# Altium schematic sheet PORT_TYPE-C.SchDoc
size 420 x 297 mm; SheetNumber: 15; SheetTotal: 23
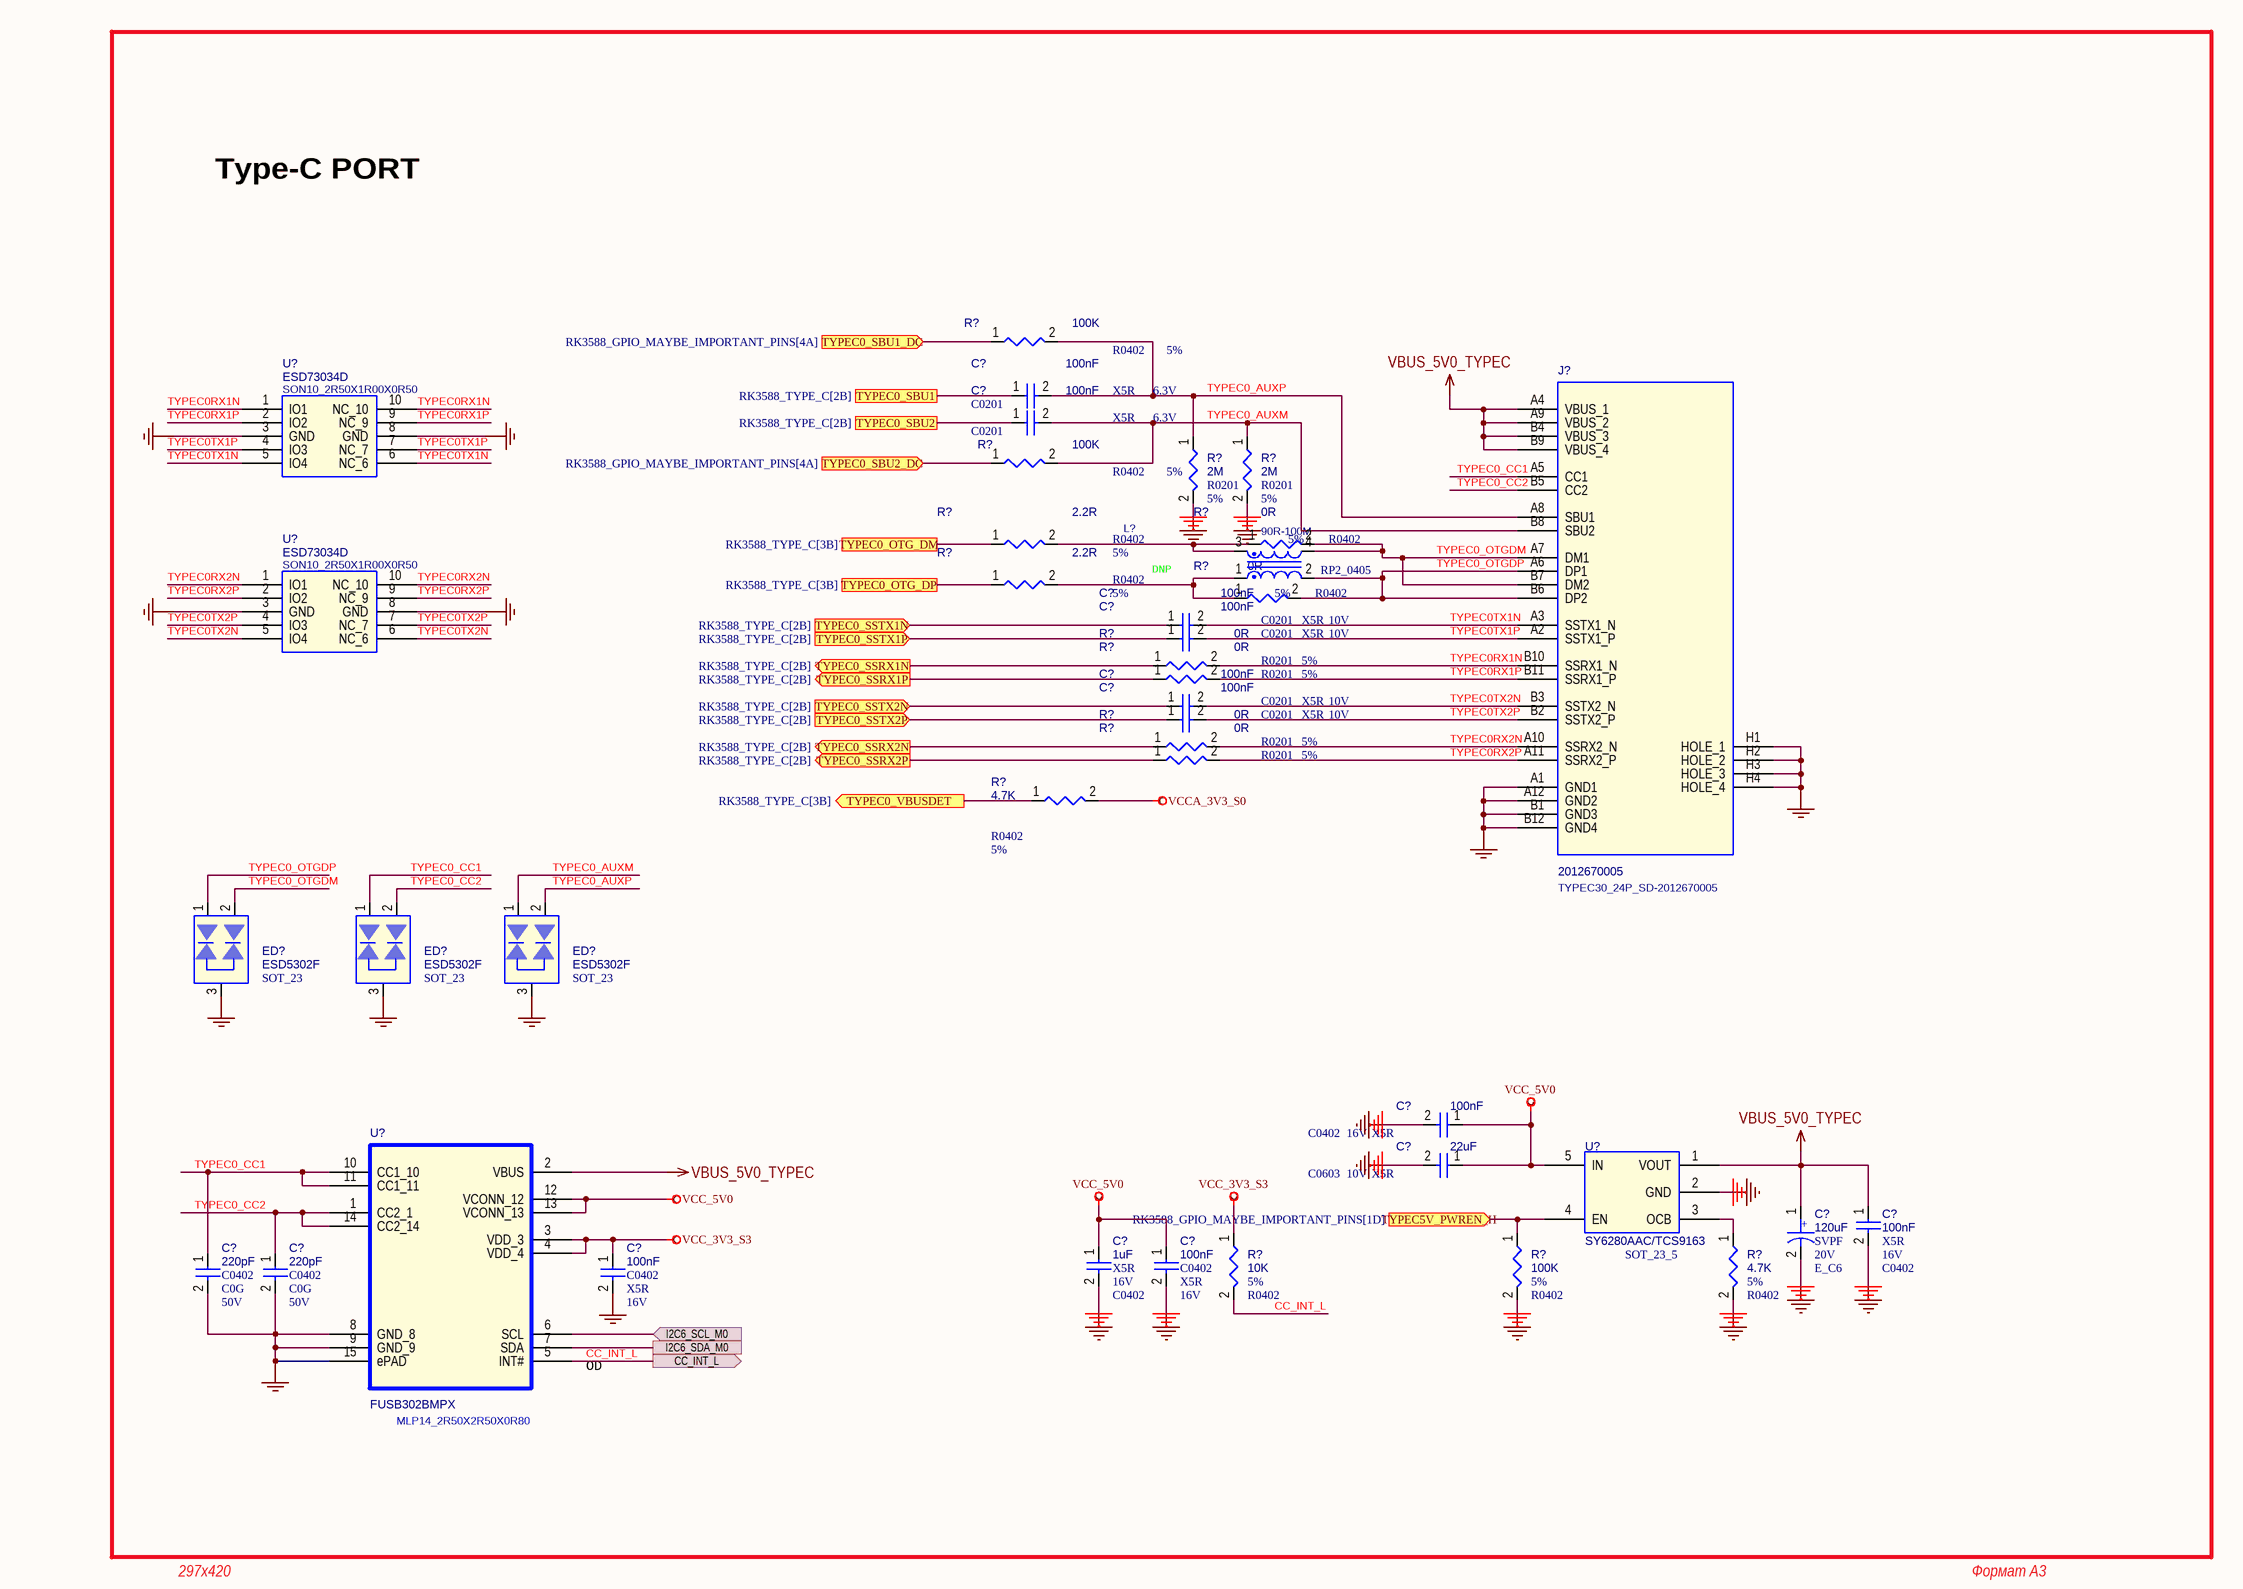
[diagram p0: PORT_TYPE-C.SchDoc]

## Parts
(Parts that share a designator on the sheet are numbered #1, #2 ... from top to bottom, then left to right.)
C?#1  100nF  Dielectric: X5R  Voltage: 6.3V  [C0201]
C?#2  100nF  Dielectric: X5R  Voltage: 6.3V  [C0201]
C?#3  100nF  Dielectric: X5R  Voltage: 10V  [C0201]
C?#4  100nF  Dielectric: X5R  Voltage: 10V  [C0201]
C?#5  100nF  Dielectric: X5R  Voltage: 10V  [C0201]
C?#6  100nF  Dielectric: X5R  Voltage: 10V  [C0201]
C?#7  100nF  Dielectric: X5R  Voltage: 16V  [C0402]
C?#8  22uF  Dielectric: X5R  Voltage: 10V  [C0603]
C?#9  120uF  Voltage: 20V  Dielectric: SVPF  [E_C6]
C?#10  100nF  Dielectric: X5R  Voltage: 16V  [C0402]
C?#11  1uF  Dielectric: X5R  Voltage: 16V  [C0402]
C?#12  100nF  Dielectric: X5R  Voltage: 16V  [C0402]
C?#13  220pF  Dielectric: C0G  Voltage: 50V  [C0402]
C?#14  220pF  Dielectric: C0G  Voltage: 50V  [C0402]
C?#15  100nF  Dielectric: X5R  Voltage: 16V  [C0402]
ED?#1  ESD5302F  [SOT_23]
ED?#2  ESD5302F  [SOT_23]
ED?#3  ESD5302F  [SOT_23]
J?  2012670005  [TYPEC30_24P_SD-2012670005]
L?  90R-100M  PCB Footprint: RP2_0405  OPTION: DNP  [L0402D]
R?#1  100K  Tolerance: 5%  [R0402]
R?#2  2M  Tolerance: 5%  PCB Footprint: R0201  [R0402]
R?#3  2M  Tolerance: 5%  PCB Footprint: R0201  [R0402]
R?#4  100K  Tolerance: 5%  [R0402]
R?#5  2.2R  Tolerance: 5%  [R0402]
R?#6  0R  Tolerance: 5%  [R0402]
R?#7  2.2R  Tolerance: 5%  [R0402]
R?#8  0R  Tolerance: 5%  [R0402]
R?#9  0R  Tolerance: 5%  PCB Footprint: R0201  [R0402]
R?#10  0R  Tolerance: 5%  PCB Footprint: R0201  [R0402]
R?#11  0R  Tolerance: 5%  PCB Footprint: R0201  [R0402]
R?#12  0R  Tolerance: 5%  PCB Footprint: R0201  [R0402]
R?#13  4.7K  Tolerance: 5%  [R0402]
R?#14  10K  Tolerance: 5%  [R0402]
R?#15  100K  Tolerance: 5%  [R0402]
R?#16  4.7K  Tolerance: 5%  [R0402]
U?#1  ESD73034D  [SON10_2R50X1R00X0R50]
U?#2  ESD73034D  [SON10_2R50X1R00X0R50]
U?#3  FUSB302BMPX  [MLP14_2R50X2R50X0R80]
U?#4  SY6280AAC/TCS9163  [SOT_23_5]

## Ports
CC_INT_L (out, see RK3588_OSC_PLL[3C]), I2C6_SCL_M0 (in, see RK3588_OSC_PLL[3C]), I2C6_SDA_M0 (see RK3588_OSC_PLL[3C]), TYPEC0_OTG_DM (see RK3588_TYPE_C[3B]), TYPEC0_OTG_DP (see RK3588_TYPE_C[3B]), TYPEC0_SBU1 (see RK3588_TYPE_C[2B]), TYPEC0_SBU1_DC (in, see RK3588_GPIO_MAYBE_IMPORTANT_PINS[4A]), TYPEC0_SBU2 (see RK3588_TYPE_C[2B]), TYPEC0_SBU2_DC (in, see RK3588_GPIO_MAYBE_IMPORTANT_PINS[4A]), TYPEC0_SSRX1N (out, see RK3588_TYPE_C[2B]), TYPEC0_SSRX1P (out, see RK3588_TYPE_C[2B]), TYPEC0_SSRX2N (out, see RK3588_TYPE_C[2B]), TYPEC0_SSRX2P (out, see RK3588_TYPE_C[2B]), TYPEC0_SSTX1N (in, see RK3588_TYPE_C[2B]), TYPEC0_SSTX1P (in, see RK3588_TYPE_C[2B]), TYPEC0_SSTX2N (in, see RK3588_TYPE_C[2B]), TYPEC0_SSTX2P (in, see RK3588_TYPE_C[2B]), TYPEC0_VBUSDET (out, see RK3588_TYPE_C[3B]), TYPEC5V_PWREN_H (in, see RK3588_GPIO_MAYBE_IMPORTANT_PINS[1D])

## Nets
GND: C?#7.2 C?#8.2 C?#9.2 C?#10.2 C?#11.2 C?#12.2 C?#13.2 C?#14.2 C?#15.2 ED?#1.3 ED?#2.3 ED?#3.3 J?.A1(GND1) J?.A12(GND2) J?.B1(GND3) J?.B12(GND4) J?.H1(HOLE_1) J?.H2(HOLE_2) J?.H3(HOLE_3) J?.H4(HOLE_4) R?#2.2 R?#3.2 R?#15.2 R?#16.2 U?#1.3(GND) U?#1.8(GND) U?#2.3(GND) U?#2.8(GND) U?#3.8(GND_8) U?#3.9(GND_9) U?#3.15(ePAD) U?#4.2(GND)
VBUS_5V0_TYPEC: C?#9.1 C?#10.1 J?.A4(VBUS_1) J?.A9(VBUS_2) J?.B4(VBUS_3) J?.B9(VBUS_4) U?#3.2(VBUS) U?#4.1(VOUT)
VCC_3V3_S3: C?#15.1 R?#14.1 U?#3.3(VDD_3) U?#3.4(VDD_4)
VCC_5V0: C?#7.1 C?#8.1 C?#11.1 C?#12.1 U?#3.12(VCONN_12) U?#3.13(VCONN_13) U?#4.5(IN)
VCCA_3V3_S0: R?#13.2
CC_INT_L: R?#14.2 U?#3.5(INT#) ; port CC_INT_L
I2C6_SCL_M0: U?#3.6(SCL) ; port I2C6_SCL_M0
I2C6_SDA_M0: U?#3.7(SDA) ; port I2C6_SDA_M0
TYPEC0_AUXM: C?#2.2 ED?#3.1 J?.B8(SBU2) R?#3.1 R?#4.2
TYPEC0_AUXP: C?#1.2 ED?#3.2 J?.A8(SBU1) R?#1.2 R?#2.1
TYPEC0_CC1: C?#13.1 ED?#2.1 J?.A5(CC1) U?#3.10(CC1_10) U?#3.11(CC1_11)
TYPEC0_CC2: C?#14.1 ED?#2.2 J?.B5(CC2) U?#3.1(CC2_1) U?#3.14(CC2_14)
TYPEC0_OTG_DM: R?#5.1 ; port TYPEC0_OTG_DM
TYPEC0_OTG_DP: R?#7.1 ; port TYPEC0_OTG_DP
TYPEC0_OTGDM: ED?#1.2 J?.A7(DM1) J?.B7(DM2) L?.4 R?#6.2
TYPEC0_OTGDP: ED?#1.1 J?.A6(DP1) J?.B6(DP2) L?.2 R?#8.2
TYPEC0_SBU1: C?#1.1 ; port TYPEC0_SBU1
TYPEC0_SBU1_DC: R?#1.1 ; port TYPEC0_SBU1_DC
TYPEC0_SBU2: C?#2.1 ; port TYPEC0_SBU2
TYPEC0_SBU2_DC: R?#4.1 ; port TYPEC0_SBU2_DC
TYPEC0_SSRX1N: R?#9.1 ; port TYPEC0_SSRX1N
TYPEC0_SSRX1P: R?#10.1 ; port TYPEC0_SSRX1P
TYPEC0_SSRX2N: R?#11.1 ; port TYPEC0_SSRX2N
TYPEC0_SSRX2P: R?#12.1 ; port TYPEC0_SSRX2P
TYPEC0_SSTX1N: C?#3.1 ; port TYPEC0_SSTX1N
TYPEC0_SSTX1P: C?#4.1 ; port TYPEC0_SSTX1P
TYPEC0_SSTX2N: C?#5.1 ; port TYPEC0_SSTX2N
TYPEC0_SSTX2P: C?#6.1 ; port TYPEC0_SSTX2P
TYPEC0_VBUSDET: R?#13.1 ; port TYPEC0_VBUSDET
TYPEC0RX1N: J?.B10(SSRX1_N) R?#9.2 U?#1.1(IO1) U?#1.10(NC_10)
TYPEC0RX1P: J?.B11(SSRX1_P) R?#10.2 U?#1.2(IO2) U?#1.9(NC_9)
TYPEC0RX2N: J?.A10(SSRX2_N) R?#11.2 U?#2.1(IO1) U?#2.10(NC_10)
TYPEC0RX2P: J?.A11(SSRX2_P) R?#12.2 U?#2.2(IO2) U?#2.9(NC_9)
TYPEC0TX1N: C?#3.2 J?.A3(SSTX1_N) U?#1.5(IO4) U?#1.6(NC_6)
TYPEC0TX1P: C?#4.2 J?.A2(SSTX1_P) U?#1.4(IO3) U?#1.7(NC_7)
TYPEC0TX2N: C?#5.2 J?.B3(SSTX2_N) U?#2.5(IO4) U?#2.6(NC_6)
TYPEC0TX2P: C?#6.2 J?.B2(SSTX2_P) U?#2.4(IO3) U?#2.7(NC_7)
TYPEC5V_PWREN_H: R?#15.1 U?#4.4(EN) ; port TYPEC5V_PWREN_H
NetL?_1: L?.1 R?#7.2 R?#8.1
NetL?_3: L?.3 R?#5.2 R?#6.1
NetR?#16_1: R?#16.1 U?#4.3(OCB)

## Notes on the sheet
- Type-C PORT
- OD
- 297x420
- Формат А3
- (in symbol CAP) +

## Library data of the parts
C?#1 = CAP NP_Dup1: cap,100.00nF,+/-10%,6.3V,X5R,C0201; Part Reference: C2600; Manufacturer: TDK; RK PN: C0603X5R0J104K030BC; Priority: A; Tolerance: 10%; PCB Footprint: C0201; Value: 100nF; Part Type: C0201; Manufacturer PN: C0603X5R0J104K030BC; Created by: JJJ
C?#2 = CAP NP_Dup1: cap,100.00nF,+/-10%,6.3V,X5R,C0201; Part Reference: C2601; Manufacturer PN: C0603X5R0J104K030BC; Manufacturer: TDK; Tolerance: 10%; Priority: A; PCB Footprint: C0201; Value: 100nF; Created by: JJJ; Part Type: C0201; RK PN: C0603X5R0J104K030BC
C?#3 = CAP NP_Dup1: cap,100.00nF,+/-10%,10V,X5R,C0201; Part Reference: C2602; Manufacturer PN: C0603X5R1A104K030BC; Manufacturer: TDK; Tolerance: 10%; Priority: A; PCB Footprint: C0201; Value: 100nF; Created by: JJJ; Part Type: C0201; RK PN: C0603X5R1A104K030BC
C?#4 = CAP NP_Dup1: cap,100.00nF,+/-10%,10V,X5R,C0201; Part Reference: C2603; Manufacturer: TDK; RK PN: C0603X5R1A104K030BC; Priority: A; Tolerance: 10%; PCB Footprint: C0201; Value: 100nF; Part Type: C0201; Manufacturer PN: C0603X5R1A104K030BC; Created by: JJJ
C?#5 = CAP NP_Dup1: cap,100.00nF,+/-10%,10V,X5R,C0201; Part Reference: C2604; Manufacturer: TDK; RK PN: C0603X5R1A104K030BC; Priority: A; Tolerance: 10%; PCB Footprint: C0201; Value: 100nF; Part Type: C0201; Manufacturer PN: C0603X5R1A104K030BC; Created by: JJJ
C?#6 = CAP NP_Dup1: cap,100.00nF,+/-10%,10V,X5R,C0201; Part Reference: C2605; Manufacturer: TDK; RK PN: C0603X5R1A104K030BC; Priority: A; Tolerance: 10%; PCB Footprint: C0201; Value: 100nF; Part Type: C0201; Manufacturer PN: C0603X5R1A104K030BC; Created by: JJJ
C?#7 = CAP NP_Dup1: cap,100.00nF,+/-10%,16V,X5R,C0402; Part Reference: C2606; Manufacturer: TDK; RK PN: C1005X5R1C104K050BA; Priority: A; C_Voltage: 6.3V; Tolerance: 10%; PCB Footprint: C0402; Value: 100nF; Part Type: C0402; Manufacturer PN: C1005X5R1C104K050BA; Created by: JJJ
C?#8 = CAP NP_Dup1: cap,22.00uF,+/-20%,10V,X5R,C0603; Part Reference: C2607; Manufacturer: TDK; RK PN: C1608X5R1A226M080AC; Priority: A; C_Voltage: 6.3V; Tolerance: 20%; PCB Footprint: C0603; Value: 22uF; Part Type: C0603; Manufacturer PN: C1608X5R1A226M080AC; Created by: JJJ
C?#9 = CAP: 120uF,20V,25mR,SVPF; Part Reference: C2610; Manufacturer: Panasonic; RK PN: 20SVPF120M; Priority: A; Tolerance: 20%; PCB Footprint: E_C6; Value: 120uF; Part Type: МщЖ¬№ММ¬ВБµзЅв; Manufacturer PN: 20SVPF120M; Created by: YWQ
C?#10 = CAP NP_Dup1: cap,100.00nF,+/-10%,16V,X5R,C0402; Part Reference: C2611; Manufacturer: TDK; RK PN: C1005X5R1C104K050BA; Priority: A; Tolerance: 10%; PCB Footprint: C0402; Value: 100nF; Part Type: C0402; Manufacturer PN: C1005X5R1C104K050BA; Created by: JJJ
C?#11 = CAP NP_Dup1: cap,1.00uF,+/-10%,16V,X5R,C0402; Part Reference: C2608; Manufacturer: TDK; RK PN: C1005X5R1C105K050BC; Priority: A; Tolerance: 10%; PCB Footprint: C0402; Value: 1uF; Part Type: C0402; Manufacturer PN: C1005X5R1C105K050BC; Created by: JJJ
C?#12 = CAP NP_Dup1: cap,100.00nF,+/-10%,16V,X5R,C0402; Part Reference: C2609; Manufacturer: TDK; RK PN: C1005X5R1C104K050BA; Priority: A; Tolerance: 10%; PCB Footprint: C0402; Value: 100nF; Part Type: C0402; Manufacturer PN: C1005X5R1C104K050BA; Created by: JJJ
C?#13 = CAP NP_Dup1: cap,220.00pF,+/-5%,50V,C0G,C0402; Part Reference: C2612; Manufacturer: TDK; RK PN: C1005C0G1H221J050BA; Priority: A; Tolerance: 5%; PCB Footprint: C0402; Value: 220pF; Part Type: C0402; Manufacturer PN: C1005C0G1H221J050BA; Created by: JJJ
C?#14 = CAP NP_Dup1: cap,220.00pF,+/-5%,50V,C0G,C0402; Part Reference: C2613; Manufacturer PN: C1005C0G1H221J050BA; Manufacturer: TDK; Tolerance: 5%; Priority: A; PCB Footprint: C0402; Value: 220pF; Created by: JJJ; Part Type: C0402; RK PN: C1005C0G1H221J050BA
C?#15 = CAP NP_Dup1: cap,100.00nF,+/-10%,16V,X5R,C0402; Part Reference: C2614; Manufacturer PN: C1005X5R1C104K050BA; Manufacturer: TDK; Tolerance: 10%; Priority: A; PCB Footprint: C0402; Value: 100nF; Created by: JJJ; Part Type: C0402; RK PN: C1005X5R1C104K050BA
ED?#1 = ESD_ESDA6V8UL: 2-Lines, Uni-directional,Ultra-low Capacitance.Transient Voltage Suppressors; Part Reference: ED2600; Manufacturer: WillSemi(О¤¶ы°лµјМе); Priority: A; PCB Footprint: SOT_23; Value: ESD5302F; Created by: JJJ; Manufacturer PN: ESD5302F; Part Type: ESD_TVS; RK PN: ESD5302F
ED?#2 = ESD_ESDA6V8UL: 2-Lines, Uni-directional,Ultra-low Capacitance.Transient Voltage Suppressors; Part Reference: ED2601; Manufacturer: WillSemi(О¤¶ы°лµјМе); Priority: A; PCB Footprint: SOT_23; Value: ESD5302F; RK PN: ESD5302F; Part Type: ESD_TVS; Manufacturer PN: ESD5302F; Created by: JJJ
ED?#3 = ESD_ESDA6V8UL: 2-Lines, Uni-directional,Ultra-low Capacitance.Transient Voltage Suppressors; Part Reference: ED2602; Manufacturer: WillSemi(О¤¶ы°лµјМе); Priority: A; PCB Footprint: SOT_23; Value: ESD5302F; Created by: JJJ; Manufacturer PN: ESD5302F; Part Type: ESD_TVS; RK PN: ESD5302F
J? = USB31_TYPE_C_24P: USB Type-CОФКЅДёЧщ,МщєёЈ¬USB3.1ЅУїЪ; Part Reference: J2600; Manufacturer: MOLEX; RK PN: SD-105450-001; Priority: A; PCB Footprint: TYPEC30_24P_SD-2012670005; Value: 2012670005; Part Type: USB Jack; Manufacturer Part Number: SD-105450-001; Created by: YWQ
L? = INDUCTOR COM: Multi-layer common mode filter array For high-speed differential signal lines.Differential mode cut-off frequency:MCZ1210AH series : 2.5GHz typ.MCZ1210CH series : 3.5GHz typ.MCZ1210DH series : 4 to 6GHz typ.; Part Reference: L2600; Manufacturer PN: MCZ1210AH900L2T; Manufacturer: EMC; Resonace frequency: 90R@100M; Irms: 200mA; DC Resistor: 1.75ohm; Priority: A; Value: 90R-100M; Created by: JJJ; Part Type: BEAD; RK PN: MCZ1210AH900L2T
R?#1 = RESISTOR_Dup2: НЁУГєсД¤µзЧи,100K,+/-5%,R0402,1/16W.; Part Reference: R2600; Manufacturer PN: RC0402JR-07100KL; Manufacturer: YAGEO; Wattage: 1/16W; Priority: A; PCB Footprint: R0402; Value: 100K; Created by: YTL; Part Type: НЁУГєсД¤µзЧи; RK PN: RC0402JR-07100KL
R?#2 = RESISTOR_Dup2: НЁУГєсД¤µзЧи,2M,+/-5%,R0201,1/20W.; Part Reference: R2601; Manufacturer: YAGEO; RK PN: RC0201JR-072ML; Priority: A; Wattage: 1/20W; Value: 2M; Part Type: НЁУГєсД¤µзЧи; Manufacturer PN: RC0201JR-072ML; Created by: YTL
R?#3 = RESISTOR_Dup2: НЁУГєсД¤µзЧи,2M,+/-5%,R0201,1/20W.; Part Reference: R2602; Manufacturer PN: RC0201JR-072ML; Manufacturer: YAGEO; Wattage: 1/20W; Priority: A; Value: 2M; Created by: YTL; Part Type: НЁУГєсД¤µзЧи; RK PN: RC0201JR-072ML
R?#4 = RESISTOR_Dup2: НЁУГєсД¤µзЧи,100K,+/-5%,R0402,1/16W.; Part Reference: R2603; Manufacturer PN: RC0402JR-07100KL; Manufacturer: YAGEO; Wattage: 1/16W; Priority: A; PCB Footprint: R0402; Value: 100K; Created by: YTL; Part Type: НЁУГєсД¤µзЧи; RK PN: RC0402JR-07100KL
R?#5 = RESISTOR_Dup2: НЁУГєсД¤µзЧи,2R2,+/-5%,R0402,1/16W.; Part Reference: R2630; Manufacturer PN: RC0402JR-072R2L; Manufacturer: YAGEO; Wattage: 1/16W; Priority: A; PCB Footprint: R0402; Value: 2.2R; Created by: YTL; Part Type: НЁУГєсД¤µзЧи; RK PN: RC0402JR-072R2L
R?#6 = RESISTOR_Dup2: НЁУГєсД¤µзЧи,0R,+/-5%,R0402,1/16W.; Part Reference: R2604; Manufacturer PN: RC0402JR-070RL; Manufacturer: YAGEO; Wattage: 1/16W; Priority: A; PCB Footprint: R0402; Value: 0R; Created by: YTL; Part Type: НЁУГєсД¤µзЧи; RK PN: RC0402JR-070RL
R?#7 = RESISTOR_Dup2: НЁУГєсД¤µзЧи,2R2,+/-5%,R0402,1/16W.; Part Reference: R2631; Manufacturer: YAGEO; RK PN: RC0402JR-072R2L; Priority: A; Wattage: 1/16W; PCB Footprint: R0402; Value: 2.2R; Part Type: НЁУГєсД¤µзЧи; Manufacturer PN: RC0402JR-072R2L; Created by: YTL
R?#8 = RESISTOR_Dup2: НЁУГєсД¤µзЧи,0R,+/-5%,R0402,1/16W.; Part Reference: R2605; Manufacturer: YAGEO; RK PN: RC0402JR-070RL; Priority: A; Wattage: 1/16W; PCB Footprint: R0402; Value: 0R; Part Type: НЁУГєсД¤µзЧи; Manufacturer PN: RC0402JR-070RL; Created by: YTL
R?#9 = RESISTOR_Dup2: НЁУГєсД¤µзЧи,0R,+/-5%,R0201,1/20W.; Part Reference: R2606; Manufacturer PN: RC0201JR-070RL; Manufacturer: YAGEO; Wattage: 1/20W; Priority: A; Value: 0R; Created by: YTL; Part Type: НЁУГєсД¤µзЧи; RK PN: RC0201JR-070RL
R?#10 = RESISTOR_Dup2: НЁУГєсД¤µзЧи,0R,+/-5%,R0201,1/20W.; Part Reference: R2607; Manufacturer: YAGEO; RK PN: RC0201JR-070RL; Priority: A; Wattage: 1/20W; Value: 0R; Part Type: НЁУГєсД¤µзЧи; Manufacturer PN: RC0201JR-070RL; Created by: YTL
R?#11 = RESISTOR_Dup2: НЁУГєсД¤µзЧи,0R,+/-5%,R0201,1/20W.; Part Reference: R2608; Manufacturer: YAGEO; RK PN: RC0201JR-070RL; Priority: A; Wattage: 1/20W; Value: 0R; Part Type: НЁУГєсД¤µзЧи; Manufacturer PN: RC0201JR-070RL; Created by: YTL
R?#12 = RESISTOR_Dup2: НЁУГєсД¤µзЧи,0R,+/-5%,R0201,1/20W.; Part Reference: R2609; Manufacturer PN: RC0201JR-070RL; Manufacturer: YAGEO; Wattage: 1/20W; Priority: A; Value: 0R; Created by: YTL; Part Type: НЁУГєсД¤µзЧи; RK PN: RC0201JR-070RL
R?#13 = RESISTOR_Dup2: НЁУГєсД¤µзЧи,4K7,+/-5%,R0402,1/16W.; Part Reference: R2610; Manufacturer: YAGEO; RK PN: RC0402JR-074K7L; Priority: A; Wattage: 1/16W; PCB Footprint: R0402; Value: 4.7K; Part Type: НЁУГєсД¤µзЧи; Manufacturer PN: RC0402JR-074K7L; Created by: YTL
R?#14 = RESISTOR_Dup2: НЁУГєсД¤µзЧи,10K,+/-5%,R0402,1/16W.; Part Reference: R2613; Manufacturer PN: RC0402JR-0710KL; Manufacturer: YAGEO; Wattage: 1/16W; Priority: A; PCB Footprint: R0402; Value: 10K; Created by: YTL; Part Type: НЁУГєсД¤µзЧи; RK PN: RC0402JR-0710KL
R?#15 = RESISTOR_Dup2: НЁУГєсД¤µзЧи,100K,+/-5%,R0402,1/16W.; Part Reference: R2611; Manufacturer: YAGEO; RK PN: RC0402JR-07100KL; Priority: A; Wattage: 1/16W; PCB Footprint: R0402; Value: 100K; Part Type: НЁУГєсД¤µзЧи; Manufacturer PN: RC0402JR-07100KL; Created by: YTL
R?#16 = RESISTOR_Dup2: НЁУГєсД¤µзЧи,4K7,+/-5%,R0402,1/16W.; Part Reference: R2612; Manufacturer: YAGEO; RK PN: RC0402JR-074K7L; Priority: A; Wattage: 1/16W; PCB Footprint: R0402; Value: 4.7K; Part Type: НЁУГєсД¤µзЧи; Manufacturer PN: RC0402JR-074K7L; Created by: YTL
U?#1 = ESD_ESD5304D: 4-Lines, Uni-directional, Ultra-low Capacitance Transient Voltage Suppressors; Part Reference: U2600; Manufacturer: WillSemi(О¤¶ы°лµјМе); Priority: A; PCB Footprint: SON10_2R50X1R00X0R50; Value: ESD73034D; Created by: JJJ; Manufacturer PN: ESD5304D; Part Type: ESD_TVS; RK PN: ESD5304D
U?#2 = ESD_ESD5304D: 4-Lines, Uni-directional, Ultra-low Capacitance Transient Voltage Suppressors; Part Reference: U2601; Manufacturer: WillSemi(О¤¶ы°лµјМе); Priority: A; PCB Footprint: SON10_2R50X1R00X0R50; Value: ESD73034D; RK PN: ESD5304D; Part Type: ESD_TVS; Manufacturer PN: ESD5304D; Created by: JJJ
U?#3 = USB_FUSB302B: Programmable USB Type-C Controller w/PD; Part Reference: U2602; Manufacturer: Fairchild(·ЙХЧ°лµјМе); Priority: A; PCB Footprint: MLP14_2R50X2R50X0R80; Value: FUSB302BMPX; Created by: JJJ; Manufacturer PN: FUSB302BMPX; Part Type: USB; RK PN: FUSB302BMPX
U?#4 = SWITCH_SY6280: Low Loss Power Distribution Switch; Part Reference: U2603; Manufacturer: SilergyЈЁОщБ¦ЅЬЈ©; Priority: A; PCB Footprint: SOT_23_5; Value: SY6280AAC/TCS9163; RK PN: SY6280AAC; Part Type: Switch; Manufacturer PN: SY6280AAC; Created by: JJJ